# Altium project IR_transmitter.PrjPcb
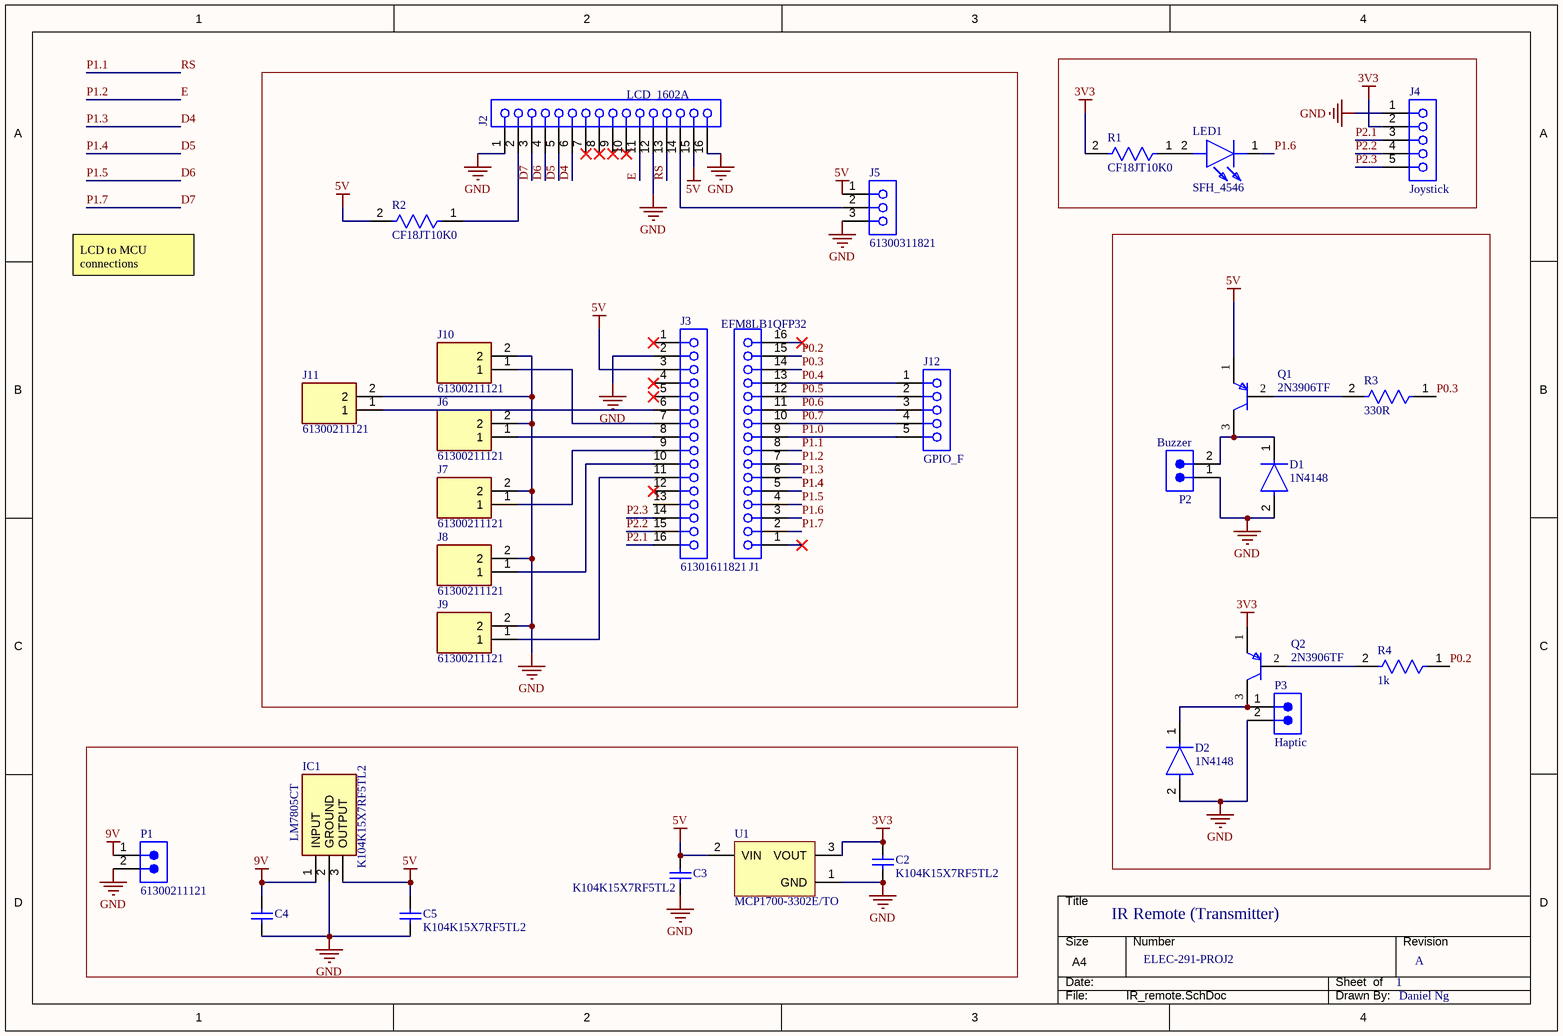
[diagram p0: IR_remote.SchDoc]
1 sheet, 30 parts. Net scope: global (net labels, ports and power ports of the same name join across sheets).
Board file: IR_remote.PcbDoc

## Sheet IR_remote.SchDoc: IR Remote (Transmitter)
size A4; DrawnBy: Daniel Ng; Organization: UBC ECE; DocumentNumber: ELEC-291-PROJ2; Revision: A; SheetNumber: 1; SheetTotal: 1

### Parts
C2  K104K15X7RF5TL2  [VISH-K104K15X7RF5TL2]
C3  K104K15X7RF5TL2  [VISH-K104K15X7RF5TL2]
C4  K104K15X7RF5TL2  [VISH-K104K15X7RF5TL2]
C5  K104K15X7RF5TL2  [VISH-K104K15X7RF5TL2]
D1  1N4148  [FP-017AG-MFG]
D2  1N4148  [FP-017AG-MFG]
IC1  LM7805CT  [TO254P470X1028X1955-3P]
J1  EFM8LB1QFP32  [61301611821]
J2  LCD_1602A  [61301611821]
J3  61301611821  [61301611821]
J4  Joystick  [61300511821]
J5  61300311821  [61300311821]
J6  61300211121  [HDRV2W110P0X254_1X2_508X254X854P]
J7  61300211121  [HDRV2W110P0X254_1X2_508X254X854P]
J8  61300211121  [HDRV2W110P0X254_1X2_508X254X854P]
J9  61300211121  [HDRV2W110P0X254_1X2_508X254X854P]
J10  61300211121  [HDRV2W110P0X254_1X2_508X254X854P]
J11  61300211121  [HDRV2W110P0X254_1X2_508X254X854P]
J12  GPIO_F  [61300511821]
LED1  SFH_4546  [SFH_4556P]
P1  61300211121  [61300211121]
P2  Buzzer  [62000211121]
P3  Haptic  [62000211121]
Q1  2N3906TF  [FP-135AR-MFG]
Q2  2N3906TF  [FP-135AR-MFG]
R1  CF18JT10K0  [FP-CF18-MFG]
R2  CF18JT10K0  [FP-CF18-MFG]
R3  330R  [FP-CF18-MFG]
R4  1k  [FP-CF18-MFG]
U1  MCP1700-3302E/TO  [TO-92-TO3]

### Nets
3V3: C2.1 J4.2 Q2.1(E) R1.2 U1.3(VOUT)
5V: C3.1 C5.2 IC1.3(OUTPUT) J2.15 J3.3 J5.1 Q1.1(E) R2.2 U1.2(VIN)
9V: C4.2 IC1.1(INPUT) P1.1
GND: C2.2 C3.2 C4.1 C5.1 D1.2(A) D2.2(A) IC1.2(GROUND) J2.1 J2.12 J2.16 J3.2 J4.1 J5.3 J6.2 J7.2 J8.2 J9.2 J10.2 J11.2 P1.2 P2.1 P3.2 U1.1(GND)
D4: J1.6 J2.6  [also labelled P1.3]
D5: J1.5 J2.5  [also labelled P1.4]
D6: J1.4 J2.4  [also labelled P1.5]
D7: J1.2 J2.3  [also labelled P1.7]
E: J1.7 J2.11  [also labelled P1.2]
P0.2: J1.15 R4.1
P0.3: J1.14 R3.1
P0.4: J1.13 J12.1
P0.5: J1.12 J12.2
P0.6: J1.11 J12.3
P0.7: J1.10 J12.4
P1.0: J1.9 J12.5
P1.1: J1.8 J2.13  [also labelled RS]
P1.6: J1.3 LED1.1(K)
P2.1: J3.16 J4.3
P2.2: J3.15 J4.4
P2.3: J3.14 J4.5
NetD1_1: D1.1(C) P2.2 Q1.3(C)
NetD2_1: D2.1(C) P3.1 Q2.3(C)
NetJ2_2: J2.2 R2.1
NetJ2_14: J2.14 J5.2
NetJ3_6: J3.6 J11.1
NetJ3_7: J3.7 J10.1
NetJ3_8: J3.8 J6.1
NetJ3_9: J3.9 J7.1
NetJ3_10: J3.10 J8.1
NetJ3_11: J3.11 J9.1
NetLED1_2: LED1.2(A) R1.1
NetQ1_2: Q1.2(B) R3.2
NetQ2_2: Q2.2(B) R4.2

Not connected (* = marked no-connect by the designer): J1 1* 16*; J2 7* 8* 9* 10*; J3 1* 4* 5* 12* 13

### Notes on the sheet
- LCD to MCU connections
- DWG. NO.
- REV.
- SHT.
- REVISION
- DESCRIPTION
- DATE
- APPROVED
- THIS DOCUMENT AND THE DATA DISCLOSED HEREIN OR HEREWITH IS THE PROPERTY OF ALTIUM LIMITED AND MAY BE FREELY DISTRIBUTED IN WHOLE. NO RIGHTS ARE RESERVED OR EXPRESS OR IMPLIED WARANTEE GIVEN.
- ENG:
- DSN:
- APPROVALS
- PROJECT
- DOCUMENT REVISION:
- DESIGN ITEM:
- CHK:
- BOM:
- REFERENCE DOCUMENTS
- PROJECT REVISION:
- TITLE
- FAB DWG:
- PCB DWG:
- ASSY DWG:
- SCALE:
- SIZE
- C
- CAGE CODE
- FILE NAME
- DWG NO.
- SHEET
- OF
- REV

### Library data of the parts
C2-C5 = CMP-2000-06508-1: Ceramic Capacitor, 100 nF, +/- 10%, 50 V, -55 to 125 degC, 2-Pin THD, RoHS, Tape and Reel; Manufacturer: Vishay; Other Names: BC1084CT; Catalog Drawings: Mono-KapSide2-15_5.58Mono-KapSide1_15; Temperature Coefficient: X7R; Voltage - Rated: 50V; Online Catalog: Mono-Kap™Series; Capacitance: 0.1µF; Size / Dimension: 0.157"Lx0.098"W(4.00mmx2.50mm); Operating Temperature: -55°C~125°C; Family: CeramicCapacitors; Manufacturer URL: http://www.vishay.com/; Standard Package: 1; Thickness (Max): -; Ratings: -; Datasheet Version: 08/2013; Package Description: 2-Pin Through Hole Device, Body 4 x 2.6 mm; Mounting Type: ThroughHole; Features: -; Lead Spacing: 0.098"(2.50mm); Tolerance: ±10%; Category: Capacitors; Mounting Technology: ThroughHole; Lead Style: Straight; Datasheet URL: http://www.vishay.com/docs/45171/kseries.pdf; Applications: GeneralPurpose; Package / Case: Radial; Height - Seated (Max): 0.220"(5.58mm); Package Reference: K104K15X7RF5TL2; Series: Mono-Kap™K; Packaging: CutTape(CT)
D1 D2 = CMP-07163-000046-1: DIODE GEN PURP 100V 200MA DO35; Forward Voltage: 1V; Max Power Dissipation: 500mW; Max Reverse Current: 5uA; Forward Current: 300mA; Current: 4A; Reverse Recovery Time: 4ns; Element Configuration: Single; Outside Diameter: 1.85mm; Capacitance: 4pF; Polarity: Standard; Max Forward Surge Current (Ifsm): 1A; Reverse Voltage: 100V; Output Current: 200mA; Average Rectified Current: 200mA; Diameter: 1.91mm; Max Repetitive Reverse Voltage (Vrrm): 100V; Current Rating: 200mA; Case/Package: DO-35; Lead Free: Lead Free; Number of Pins: 2; Recovery Time: 4ns; Packaging: Bulk; Contact Plating: Tin; Voltage: 100V; Mount: Through Hole; Max Surge Current: 4A; Package Quantity: 2000; Width: 1.91mm; Max Reverse Voltage (DC): 100V; Length: 4.56mm; Radiation Hardening: No; Power Dissipation: 500mW; Voltage Rating (DC): 100V; Peak Non-Repetitive Surge Current: 4A; REACH SVHC: No SVHC; Height: 4.56mm; Max Operating Temperature: 175°C; Series: -; Weight: 0.01lb; Min Operating Temperature: -65°C
IC1 = LM7805CT: Integrated Circuit; Manufacturer_Name: Texas Instruments; Datasheet Link: http://www.ti.com/lit/ds/symlink/lm340.pdf; Height: 4.7mm; Manufacturer_Part_Number: LM7805CT; Mouser Part Number: 926-LM7805CT; Mouser Price/Stock: https://www.mouser.co.uk/ProductDetail/Texas-Instruments/LM7805CT?qs=QbsRYf82W3EaqXeMDVwIfQ%3D%3D; Arrow Part Number: LM7805CT; Arrow Price/Stock: https://www.arrow.com/en/products/lm7805ct/texas-instruments?region=europe
J1-J3 = CMP-1502-01343-4: THT Vertical Socket Header WR-PHD, Pitch 2.54 mm, Single Row, 16 pins; Gender: Female; Operating Supply Voltage: 250V; Contact Resistance: 20mΩ; Current Rating: 3A; Number of Pins: 16; Orientation: Vertical; Lead Pitch: 2.54mm; RoHS: Compliant; Lead Free: Lead Free; Contact Material: Copper
J4 J12 = CMP-1502-01320-4: THT Vertical Socket Header WR-PHD, Pitch 2.54 mm, Single Row, 5 pins; Gender: Female; Contact Resistance: 20mΩ; Operating Supply Voltage: 250V; Current Rating: 3A; Number of Pins: 5; Lead Pitch: 2.54mm; Orientation: Vertical
J5 = CMP-1502-01315-4: Btb Conn, Rcpt, 3Pos, 1Row, 2.54Mm Rohs Compliant: Yes; Current Rating: 3A; Operating Supply Voltage: 250V; Contact Resistance: 20mΩ; Gender: Female; Number of Pins: 3; Lead Pitch: 2.54mm; RoHS: Non-Compliant; Orientation: Vertical
J6-J11 = 61300211121: Connector; Manufacturer_Name: Wurth Elektronik; Datasheet Link: https://www.we-online.com/catalog/datasheet/61300211121.pdf; Height: 8.54mm; Manufacturer_Part_Number: 61300211121; Mouser Part Number: 710-61300211121; Mouser Price/Stock: https://www.mouser.co.uk/ProductDetail/Wurth-Elektronik/61300211121?qs=t4813l51qx%252B1A5GYDQxPlw%3D%3D
LED1 = SFH_4546: LED; Manufacturer_Name: ams OSRAM; Datasheet Link: https://datasheet.datasheetarchive.com/originals/distributors/DKDS41/DSANUWW0036912.pdf; Manufacturer_Part_Number: SFH 4546; Mouser Part Number: 720-SFH4546; Mouser Price/Stock: https://www.mouser.co.uk/ProductDetail/OSRAM-Opto-Semiconductors/SFH-4546?qs=VcOkZLzzauarreCVxaCHEQ%3D%3D; Arrow Part Number: SFH 4546; Arrow Price/Stock: https://www.arrow.com/en/products/sfh-4546/ams-osram?utm_currency=USD&region=nac
P1 = CMP-1712-00002-7: THT Vertical Pin Header WR-PHD, Pitch 2.54 mm, Single Row, 2 pins; Pitch: 2.54mm; Number of Contacts: 2; Connector Type: Male Pin; Gender: Male; Contact Resistance: 20mΩ; Operating Supply Voltage: 250V; Current Rating: 3A; Housing Material: PBT; RoHS: Compliant; Lead Free: Lead Free; Contact Material: Gold; REACH SVHC: No; Min Operating Temperature: -40°C; Termination: Through Hole; Number of Pins: 2; Contact Gender: Male; Packaging: Bulk; Lead Pitch: 2.54mm; Contact Plating: Gold; Orientation: Vertical; Mount: Through Hole; Height: 8.94mm; Color: Black; Number of Positions: 2; Contact Mating Length: 5.9944mm; Max Operating Temperature: 105°C; Voltage Rating: 250V; Number of Rows: 1
P2 P3 = CMP-1502-00956-5: THT Vertical Pin Header WR-PHD, Pitch 2.00 mm, Single Row, 2 pins; Number of Contacts: 2; Operating Supply Voltage: 200V; Gender: Male; Contact Resistance: 20mΩ; Current Rating: 2A; RoHS: Compliant; Number of Pins: 2; Orientation: Vertical; Lead Pitch: 2mm; Min Operating Temperature: -40°C; Max Operating Temperature: 105°C; Number of Rows: 1; Voltage Rating: 200V; Contact Material: Gold; Height: 6.35mm
Q1 Q2 = CMP-00278-84408866-1: 2N3906TF Small Signal Bipolar Transistor, 0.2A I(C), 40V V(BR)CEO, 1-Element, PNP, Silicon, TO-92; Manufacturer Lifecycle Status: ACTIVE; Collector Base Voltage (VCBO): -40V; Frequency: 250MHz; Number of Elements: 1; Max Power Dissipation: 625mW; Max Breakdown Voltage: 160V; Current Rating: -200mA; Emitter Base Voltage (VEBO): -5V; Collector Emitter Saturation Voltage: -400mV; Element Configuration: Single; Max Junction Temperature (Tj): 150°C; hFE Min: 100; Polarity: PNP; Lead Free: Lead Free; RoHS: Compliant; Max Operating Temperature: 150°C; Collector Emitter Voltage (VCEO): -40V; Max Frequency: 250MHz; Power Dissipation: 625mW; Height: 5.33mm; Schedule B: 8541210080; Mount: Through Hole; Length: 5.2mm; REACH SVHC: No SVHC; Min Operating Temperature: -55°C; Gain Bandwidth Product: 250MHz; Number of Pins: 3; Lifecycle Status: Production; Transition Frequency: 250MHz; NexarPartId: 84408866; Collector Emitter Breakdown Voltage: -40V; Case/Package: TO-92; Packaging: Tape and Reel; Width: 4.19mm; Max Collector Current: -200mA; Radiation Hardening: No; Weight: 240mg; Voltage Rating (DC): -40V
R1 R2 = CMP-26528-000002-1: RES 10K OHM 1/8W 5% CF AXIAL; Manufacturer: Stackpole Electronics; Power Rating: 0.125W; Temperature Coefficient: 0-500ppm/°C; Resistance: 10kΩ; Voltage Rating: 250V; Value: 10kΩ; Temperature: -55°C to +155°C; Height: 2mm; Lead Free: Yes; Automotive: No; Device Class L2: Resistors; Package: CF18; Series: CF; ComponentLink2Description: Datasheet; Ipc Land Pattern Name: RESAD656W65L360D200; Manufacturer Part Number: CF18JT10K0; Temperature Range High: +155°C; RoHS: TRUE; Device Class L3: Through-Hole Resistors; Temperature Range Low: -55°C; Device Class L1: Passive Components; Category: Res; Octopart: https://octopart.com/cf18jt10k0-stackpole+electronics-19205642; Composition: Carbon Film; Digikey Description: RES 10K OHM 1/8W 5% CF AXIAL; ComponentLink2URL: http://www.seielect.com/Catalog/SEI-CF_CFM.pdf; Tolerance: 5%
R3 R4 = CMP-26528-000002-1: RES 10K OHM 1/8W 5% CF AXIAL; Manufacturer Part Number: CF18JT10K0; Manufacturer: Stackpole Electronics; Power Rating: 0.125W; Temperature Coefficient: 0-500ppm/°C; Resistance: 10kΩ; Voltage Rating: 250V; Value: 10kΩ; Temperature: -55°C to +155°C; Height: 2mm; Lead Free: Yes; Automotive: No; Device Class L2: Resistors; Package: CF18; Series: CF; ComponentLink2Description: Datasheet; Ipc Land Pattern Name: RESAD656W65L360D200; Temperature Range High: +155°C; RoHS: TRUE; Device Class L3: Through-Hole Resistors; Temperature Range Low: -55°C; Device Class L1: Passive Components; Category: Res; Octopart: https://octopart.com/cf18jt10k0-stackpole+electronics-19205642; Composition: Carbon Film; Digikey Description: RES 10K OHM 1/8W 5% CF AXIAL; ComponentLink2URL: http://www.seielect.com/Catalog/SEI-CF_CFM.pdf; Tolerance: 5%
U1 = CMP-0136-00007-1: Low Quiescent Current LDO, 3-Pin TO-92, Extended TemperatureBAG; PackageReference: TO-92-TO3; PackageDescription: 3-Lead Plastic Transistor Outline (TO) [TO-92]; DatasheetVersion: revB, Feb-2007; PackageVersion: revBB, Aug-2009